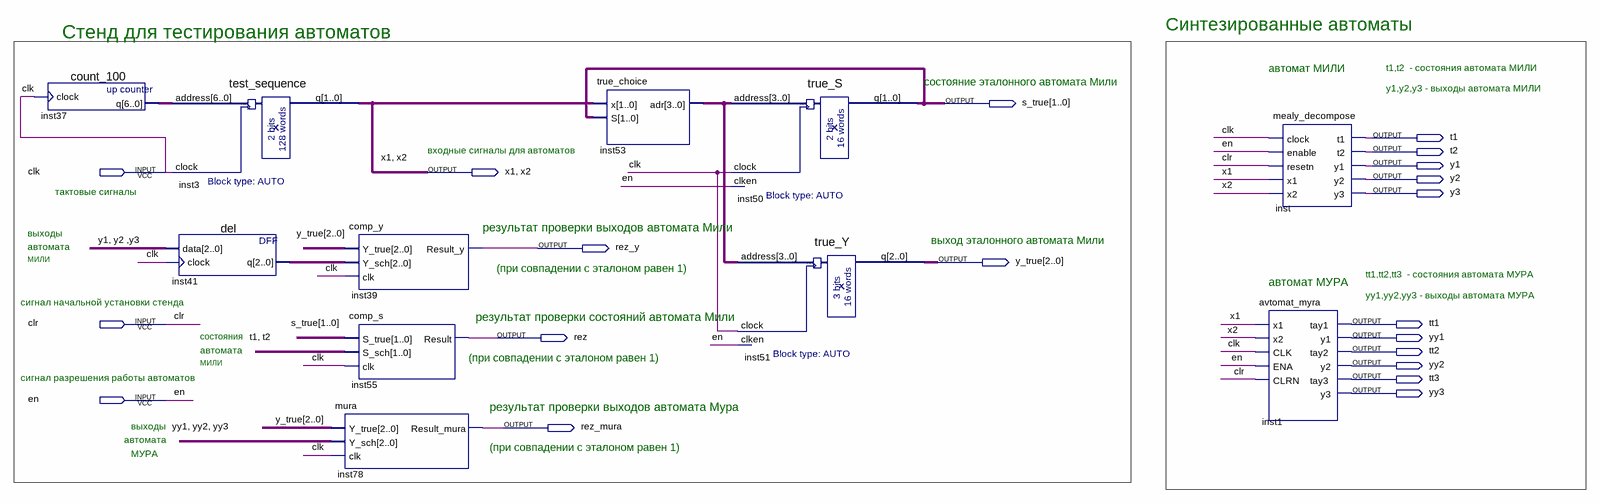
[diagram p0: schematic sheet]
// Quartus schematic tstand.bdf as structural Verilog: 11 symbols, 20 pins
module tstand (
  input  clk,
  input  clr,
  input  en,
  output [1:0] s_true,
  output t1,
  output t2,
  output y1,
  output x1,
  output x2,
  output y2,
  output y3,
  output rez_y,
  output [2:0] y_true,
  output tt1,
  output rez,
  output yy1,
  output tt2,
  output yy2,
  output tt3,
  output yy3,
  output rez_mura
);

  wire [2:0] inst41_q;
  wire [3:0] inst53_adr;
  wire [6:0] inst37_q;

  count_100 inst37 (.clock(clk), .q(inst37_q));
  test_sequence inst3 (.address(inst37_q), .clock(clk), .q({x1, x2}));
  del inst41 (.data({y1, y2, y3}), .clock(clk), .q(inst41_q));
  comp_y inst39 (.Y_true(y_true), .Y_sch(inst41_q), .clk(clk), .Result_y(rez_y));
  comp_s inst55 (.S_true(s_true), .S_sch({t1, t2}), .clk(clk), .Result(rez));
  mura inst78 (.Y_true(y_true), .Y_sch({yy1, yy2, yy3}), .clk(clk), .Result_mura(rez_mura));
  true_choice inst53 (.x({x1, x2}), .S(s_true), .adr(inst53_adr));
  true_S inst50 (.address(inst53_adr), .clock(clk), .clken(en), .q(s_true));
  true_Y inst51 (.address(inst53_adr), .clock(clk), .clken(en), .q(y_true));
  avtomat_myra inst1 (
    .x1(x1), .x2(x2), .CLK(clk), .ENA(en), .CLRN(clr), .tay1(tt1), .y1(yy1), .tay2(tt2), .y2(yy2),
    .tay3(tt3), .y3(yy3));
  mealy_decompose inst (
    .clock(clk), .enable(en), .resetn(clr), .x1(x1), .x2(x2), .t1(t1), .t2(t2), .y1(y1), .y2(y2), .y3(y3));

  // Notes on the sheet:
  //   Синтезированные автоматы
  //   Стенд для тестирования автоматов
  //   автомат МИЛИ
  //   t1,t2  - состояния автомата МИЛИ
  //   состояние эталонного автомата Мили
  //   y1,y2,y3 - выходы автомата МИЛИ
  //   входные сигналы для автоматов
  //   тактовые сигналы
  //   результат проверки выходов автомата Мили
  //   выходы
  //   выход эталонного автомата Мили
  //   автомата
  //   МИЛИ
  //   (при совпадении с эталоном равен 1)
  //   tt1,tt2,tt3  - состояния автомата МУРА
  //   автомат МУРА
  //   yy1,yy2,yy3 - выходы автомата МУРА
  //   сигнал начальной установки стенда
  //   результат проверки состояний автомата Мили
  //   состояния
  //   автомата
  //   (при совпадении с эталоном равен 1)
  //   МИЛИ
  //   сигнал разрешения работы автоматов
  //   результат проверки выходов автомата Мура
  //   выходы
  //   автомата
  //   (при совпадении с эталоном равен 1)
  //   МУРА
endmodule
